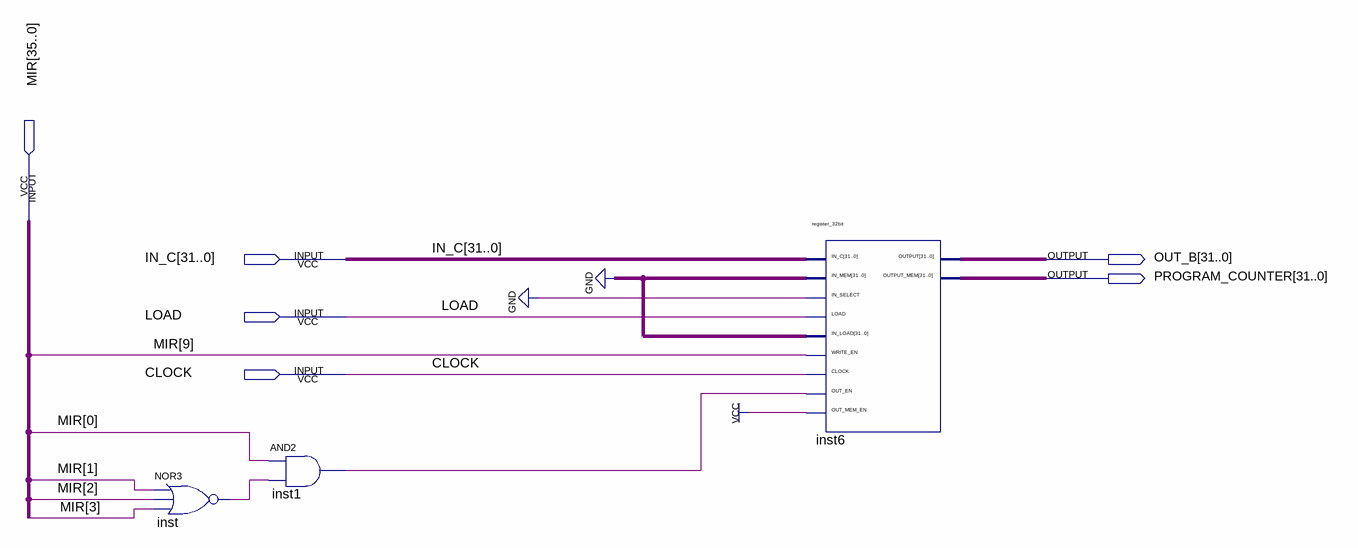
[diagram p0: schematic sheet]
// Quartus schematic PC.bdf as structural Verilog: 3 symbols, 6 pins
module PC (
  input  [35:0] MIR,
  input  [31:0] IN_C,
  input  LOAD,
  input  CLOCK,
  output [31:0] OUT_B,
  output [31:0] PROGRAM_COUNTER
);

  wire inst1_out, inst_out;

  nor inst (inst_out, MIR[1], MIR[2], MIR[3]);
  and inst1 (inst1_out, MIR[0], inst_out);
  register_32bit inst6 (
    .IN_LOAD({32{1'b0}}), .IN_C(IN_C), .LOAD(LOAD), .IN_MEM({32{1'b0}}), .IN_SELECT(1'b0), .WRITE_EN(MIR[9]),
    .CLOCK(CLOCK), .OUT_EN(inst1_out), .OUT_MEM_EN(1'b1), .OUTPUT(OUT_B), .OUTPUT_MEM(PROGRAM_COUNTER));
endmodule
